# Altium project TLV5617_yusnows.PrjPcb
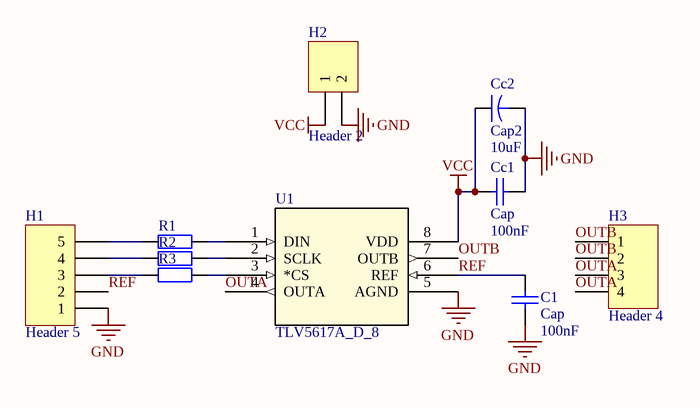
[diagram p0: TLV5617_yusnows.SchDoc]
1 sheet, 10 parts. Net scope: global (net labels, ports and power ports of the same name join across sheets).
Board file: TLV5617_yusnows.PcbDoc

## Sheet TLV5617_yusnows.SchDoc
size A4

### Parts
C1  Cap  value 100nF  [0805C]
Cc1  Cap  value 100nF  [0805C]
Cc2  Cap2  value 10uF  [CAP_SMD_3216]
H1  Header 5  [HDR1X5]
H2  Header 2  [HDR1X2]
H3  Header 4  [HDR1X4]
R1  Rin1  [0805R]  (value not drawn)
R2  Rin1  [0805R]  (value not drawn)
R3  Rin1  [0805R]  (value not drawn)
U1  TLV5617A_D_8  [D8]

### Nets
GND: C1.2 Cc1.1 Cc2.2 H1.1 H2.2 U1.5(AGND)
VCC: Cc1.2 Cc2.1 H2.1 U1.8(VDD)
OUTA: H3.3 H3.4 U1.4(OUTA)
OUTB: H3.1 H3.2 U1.7(OUTB)
REF: C1.1 H1.2 U1.6(REF)
NetH1_3: H1.3 R3.1
NetH1_4: H1.4 R2.1
NetH1_5: H1.5 R1.1
NetR1_2: R1.2 U1.1(DIN)
NetR2_2: R2.2 U1.2(SCLK)
NetR3_2: R3.2 U1.3(*CS)

### Library data of the parts
C1 Cc1 = Cap: Capacitor; Published: 8-Jun-2000; LatestRevisionDate: 17-Jul-2002; LatestRevisionNote: Re-released for DXP Platform.; PackageReference: RAD-0.3; Publisher: Altium Limited; PackageDescription: Radial Cap, Thru-Hole; 2 Leads; 0.3 in Pin Spacing
Cc2 = Cap2: Capacitor; Published: 23-Sep-2002; PackageReference: CAPR5-4X5; Publisher: Altium Limited; PackageDescription: Capacitor; 2 Leads
H1 = Header 5: Header, 5-Pin; LatestRevisionDate: 17-Jul-2002; LatestRevisionNote: Re-released for DXP Platform.; Publisher: Altium Limited
H2 = Header 2: Header, 2-Pin; LatestRevisionDate: 17-Jul-2002; LatestRevisionNote: Re-released for DXP Platform.; Publisher: Altium Limited
H3 = Header 4: Header, 4-Pin; LatestRevisionDate: 17-Jul-2002; LatestRevisionNote: Re-released for DXP Platform.; Publisher: Altium Limited
R1-R3 = Res2: Resistor; Value: 1K; Published: 8-Jun-2000; LatestRevisionDate: 17-Jul-2002; LatestRevisionNote: Re-released for DXP Platform.; PackageReference: AXIAL-0.4; Publisher: Altium Limited; PackageDescription: Axial Device, Thru-Hole; 2 Leads; 0.4 in Pin Spacing
U1 = TLV5617A_D_8: Imported; Vendor: Texas Instruments; PACKAGE_DESIGNATOR: D; PIN_COUNT: 8; FAMILY_NAME: PRECISION DAC (=<10MSPS); INDUSTRY_STD_PKG_TYPE: SOIC; Manufacturer_Part_Number: tlv5617a_d_8; GENERIC_PART_NUMBER: TLV5617A; Manufacturer: Texas Instruments; Datasheet_URL: http://www.ti.com/lit/gpn/TLV5617A; Value: Value; Type: Type; RefDes: RefDes